# Altium project PCB_Project.PrjPcb (part 2 of 2)
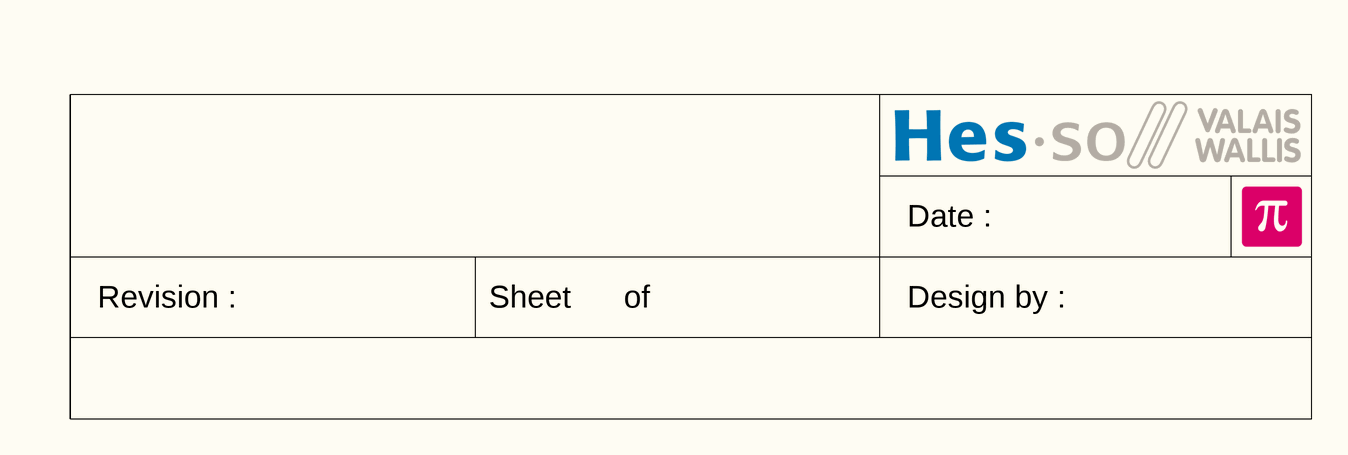
[diagram p12: UserInterface_0.SchDoc, right]

## Nets that join several sheets
+1.2V_CORE: FPGA_1 (31 pins), Supply_0 (R62.2)
+3V3_BACKPLANE: Connector_0 (6 pins), Supply_0 (6 pins)
+3V3_D: FPGA_0 (R26.2 R29.2 R57.2), FPGA_1 (97 pins), Ethernet_0 (13 pins), Connector_0 (12 pins), Supply_0 (J8.2), UserInterface_0 (7 pins)
+5V_MEZZA: Connector_0 (J2.a25 J11.a25), Supply_0 (J7.2)
GND_D: FPGA_0 (R27.1 R28.1 R56.1), FPGA_1 (113 pins), Ethernet_0 (29 pins), Connector_0 (58 pins), Supply_0 (13 pins), UserInterface_0 (14 pins)
NetC29_2: FPGA_0 (U2.B2), UserInterface_0 (C29.2 R49.1 S4.2)
NetC30_2: FPGA_0 (U2.B1), UserInterface_0 (C30.2 R50.1 S5.2)
NetC31_2: FPGA_0 (U2.G7), UserInterface_0 (C31.2 R51.1 S3.2)
NetC34_2: FPGA_0 (U2.J7), FPGA_1 (C34.2 R36.1 S2.2)
NetD2_1: FPGA_0 (U2.V2), Ethernet_0 (D2.1)
NetIC1_18: FPGA_0 (U2.M5), Ethernet_0 (IC1.18 R13.1)
NetIC1_19: FPGA_0 (U2.M4), Ethernet_0 (IC1.19)
NetIC1_20: FPGA_0 (U2.M6), Ethernet_0 (IC1.20)
NetIC1_21: FPGA_0 (U2.P4), Ethernet_0 (IC1.21)
NetIC1_22: FPGA_0 (U2.R4), Ethernet_0 (IC1.22)
NetIC1_23: FPGA_0 (U2.M8), Ethernet_0 (IC1.23)
NetIC1_27: FPGA_0 (U2.N7), Ethernet_0 (IC1.27)
NetIC1_28: FPGA_0 (U2.N6), Ethernet_0 (IC1.28)
NetIC1_29: FPGA_0 (U2.M7), Ethernet_0 (IC1.29)
NetIC1_32: FPGA_0 (U2.L6), Ethernet_0 (IC1.32)
NetIC1_33: FPGA_0 (U2.P6), Ethernet_0 (IC1.33)
NetIC1_34: FPGA_0 (U2.P5), Ethernet_0 (IC1.34)
NetIC1_35: FPGA_0 (U2.T4), Ethernet_0 (IC1.35)
NetIC1_36: FPGA_0 (U2.T3), Ethernet_0 (IC1.36)
NetIC1_38: FPGA_0 (U2.U4), Ethernet_0 (IC1.38)
NetIC1_39: FPGA_0 (U2.V3), Ethernet_0 (IC1.39)
NetIC1_40: FPGA_0 (U2.P3), Ethernet_0 (IC1.40)
NetIC1_41: FPGA_0 (U2.N4), Ethernet_0 (IC1.41)
NetJ1_a2: FPGA_0 (U2.AB11), Connector_0 (J1.a2 J10.a2), UserInterface_0 (JP1.2)
NetJ1_a3: FPGA_0 (U2.AA8), Connector_0 (J1.a3 J10.a3), UserInterface_0 (JP2.2)
NetJ1_a4: FPGA_0 (U2.AB8), Connector_0 (J1.a4 J10.a4), UserInterface_0 (JP3.2)
NetJ1_a5: FPGA_0 (U2.Y3), Connector_0 (J1.a5 J10.a5), UserInterface_0 (JP4.2)
NetJ1_a6: FPGA_0 (U2.AB3), Connector_0 (J1.a6 J10.a6)
NetJ1_a8: FPGA_0 (U2.AA10), Connector_0 (J1.a8 J10.a8)
NetJ1_a9: FPGA_0 (U2.AB10), Connector_0 (J1.a9 J10.a9)
NetJ1_a11: FPGA_0 (U2.AA12), Connector_0 (J1.a11 J10.a11)
NetJ1_a12: FPGA_0 (U2.AB12), Connector_0 (J1.a12 J10.a12)
NetJ1_b2: FPGA_0 (U2.AB16), Connector_0 (J1.b2 J10.b2)
NetJ1_b3: FPGA_0 (U2.Y13), Connector_0 (J1.b3 J10.b3)
NetJ1_b4: FPGA_0 (U2.W12), Connector_0 (J1.b4 J10.b4)
NetJ1_b5: FPGA_0 (U2.Y12), Connector_0 (J1.b5 J10.b5)
NetJ1_b6: FPGA_0 (U2.Y15), Connector_0 (J1.b6 J10.b6)
NetJ1_b8: FPGA_0 (U2.AA14), Connector_0 (J1.b8 J10.b8)
NetJ1_b9: FPGA_0 (U2.AB14), Connector_0 (J1.b9 J10.b9)
NetJ1_b11: FPGA_0 (U2.AA18), Connector_0 (J1.b11 J10.b11)
NetJ1_b12: FPGA_0 (U2.V15), Connector_0 (J1.b12 J10.b12)
NetJ1_b13: FPGA_0 (U2.AB18), Connector_0 (J1.b13 J10.b13)
NetJ1_b21: FPGA_0 (U2.F15), Connector_0 (J1.b21 J10.b21)
NetJ1_b22: FPGA_0 (U2.F14), Connector_0 (J1.b22 J10.b22)
NetJ1_b23: FPGA_0 (U2.A4), Connector_0 (J1.b23 J10.b23)
NetJ1_b25: FPGA_0 (U2.C5), Connector_0 (J1.b25 J10.b25)
NetJ2_a2: FPGA_0 (U2.A8), Connector_0 (J2.a2 J11.a2)
NetJ2_a3: FPGA_0 (U2.D9), Connector_0 (J2.a3 J11.a3)
NetJ2_a4: FPGA_0 (U2.C8), Connector_0 (J2.a4 J11.a4)
NetJ2_a6: FPGA_0 (U2.C9), Connector_0 (J2.a6 J11.a6)
NetJ2_a7: FPGA_0 (U2.D12), Connector_0 (J2.a7 J11.a7)
NetJ2_a8: FPGA_0 (U2.F13), Connector_0 (J2.a8 J11.a8)
NetJ2_a9: FPGA_0 (U2.A12), Connector_0 (J2.a9 J11.a9)
NetJ2_a10: FPGA_0 (U2.C13), Connector_0 (J2.a10 J11.a10)
NetJ2_a11: FPGA_0 (U2.A11), Connector_0 (J2.a11 J11.a11)
NetJ2_a13: FPGA_0 (U2.D11), Connector_0 (J2.a13 J11.a13)
NetJ2_a14: FPGA_0 (U2.C12), Connector_0 (J2.a14 J11.a14)
NetJ2_a16: FPGA_0 (U2.B12), Connector_0 (J2.a16 J11.a16)
NetJ2_a18: FPGA_0 (U2.A13), Connector_0 (J2.a18 J11.a18)
NetJ2_a19: FPGA_0 (U2.H13), Connector_0 (J2.a19 J11.a19)
NetJ2_a20: FPGA_0 (U2.H14), Connector_0 (J2.a20 J11.a20)
NetJ2_a21: FPGA_0 (U2.D14), Connector_0 (J2.a21 J11.a21)
NetJ2_a22: FPGA_0 (U2.G13), Connector_0 (J2.a22 J11.a22)
NetJ2_a23: FPGA_0 (U2.E14), Connector_0 (J2.a23 J11.a23)
NetJ2_a24: FPGA_0 (U2.C14), Connector_0 (J2.a24 J11.a24)
NetJ2_b2: FPGA_0 (U2.C10), Connector_0 (J2.b2 J11.b2)
NetJ2_b3: FPGA_0 (U2.B10), Connector_0 (J2.b3 J11.b3)
NetJ2_b4: FPGA_0 (U2.A10), Connector_0 (J2.b4 J11.b4)
NetJ2_b6: FPGA_0 (U2.C11), Connector_0 (J2.b6 J11.b6)
NetJ2_b7: FPGA_0 (U2.D8), Connector_0 (J2.b7 J11.b7)
NetJ2_b8: FPGA_0 (U2.D10), Connector_0 (J2.b8 J11.b8)
NetJ2_b9: FPGA_0 (U2.D13), Connector_0 (J2.b9 J11.b9)
NetJ2_b10: FPGA_0 (U2.D7), Connector_0 (J2.b10 J11.b10)
NetJ2_b11: FPGA_0 (U2.A9), Connector_0 (J2.b11 J11.b11)
NetJ2_b13: FPGA_0 (U2.E12), Connector_0 (J2.b13 J11.b13)
NetJ2_b16: FPGA_0 (U2.A7), Connector_0 (J2.b16 J11.b16)
NetJ2_b18: FPGA_0 (U2.B8), Connector_0 (J2.b18 J11.b18)
NetJ2_b19: FPGA_0 (U2.C6), Connector_0 (J2.b19 J11.b19)
NetJ2_b20: FPGA_0 (U2.B6), Connector_0 (J2.b20 J11.b20)
NetJ2_b21: FPGA_0 (U2.A5), Connector_0 (J2.b21 J11.b21)
NetJ2_b22: FPGA_0 (U2.D6), Connector_0 (J2.b22 J11.b22)
NetJ2_b23: FPGA_0 (U2.A6), Connector_0 (J2.b23 J11.b23)
NetJ2_b24: FPGA_0 (U2.C7), Connector_0 (J2.b24 J11.b24)
NetJ3_3: FPGA_1 (U2.C18), Connector_0 (J3.3 R4.1)
NetJ3_5: FPGA_1 (U2.G15), Connector_0 (J3.5 R3.1)
NetJ3_7: FPGA_1 (U2.A19), Connector_0 (J3.7 R2.1)
NetJ3_9: FPGA_1 (U2.E18), Connector_0 (J3.9 R1.1)
NetJ4_A2: FPGA_0 (U2.C19), Connector_0 (J4.A2)
NetJ4_A3: FPGA_0 (U2.B20), Connector_0 (J4.A3)
NetJ4_A5: FPGA_0 (U2.G16), Connector_0 (J4.A5)
NetJ4_A6: FPGA_0 (U2.G17), Connector_0 (J4.A6)
NetJ4_A8: FPGA_0 (U2.F16), Connector_0 (J4.A8)
NetJ4_A9: FPGA_0 (U2.F17), Connector_0 (J4.A9)
NetJ4_A11: FPGA_0 (U2.B21), Connector_0 (J4.A11)
NetJ4_A12: FPGA_0 (U2.B22), Connector_0 (J4.A12)
NetJ4_A14: FPGA_0 (U2.H19), Connector_0 (J4.A14)
NetJ4_A15: FPGA_0 (U2.H18), Connector_0 (J4.A15)
NetJ4_A16: FPGA_0 (U2.E20), Connector_0 (J4.A16)
NetJ4_A17: FPGA_0 (U2.E22), Connector_0 (J4.A17)
NetJ4_A19: FPGA_0 (U2.J17), Connector_0 (J4.A19)
NetJ4_A20: FPGA_0 (U2.K17), Connector_0 (J4.A20)
NetJ4_A21: FPGA_0 (U2.F21), Connector_0 (J4.A21)
NetJ4_A22: FPGA_0 (U2.F22), Connector_0 (J4.A22)
NetJ4_A24: FPGA_0 (U2.H20), Connector_0 (J4.A24)
NetJ4_A25: FPGA_0 (U2.J19), Connector_0 (J4.A25)
NetJ4_A26: FPGA_0 (U2.G20), Connector_0 (J4.A26)
NetJ4_A27: FPGA_0 (U2.G22), Connector_0 (J4.A27)
NetJ4_A29: FPGA_0 (U2.M19), Connector_0 (J4.A29)
NetJ4_B2: FPGA_0 (U2.A20), Connector_0 (J4.B2)
NetJ4_B3: FPGA_0 (U2.A21), Connector_0 (J4.B3)
NetJ4_B5: FPGA_0 (U2.K16), Connector_0 (J4.B5)
NetJ4_B6: FPGA_0 (U2.J16), Connector_0 (J4.B6)
NetJ4_B8: FPGA_0 (U2.H16), Connector_0 (J4.B8)
NetJ4_B9: FPGA_0 (U2.H17), Connector_0 (J4.B9)
NetJ4_B11: FPGA_0 (U2.D19), Connector_0 (J4.B11)
NetJ4_B12: FPGA_0 (U2.D20), Connector_0 (J4.B12)
NetJ4_B14: FPGA_0 (U2.K20), Connector_0 (J4.B14)
NetJ4_B15: FPGA_0 (U2.K19), Connector_0 (J4.B15)
NetJ4_B16: FPGA_0 (U2.H21), Connector_0 (J4.B16)
NetJ4_B17: FPGA_0 (U2.H22), Connector_0 (J4.B17)
NetJ4_B19: FPGA_0 (U2.M20), Connector_0 (J4.B19)
NetJ4_B20: FPGA_0 (U2.L19), Connector_0 (J4.B20)
NetJ4_B21: FPGA_0 (U2.J20), Connector_0 (J4.B21)
NetJ4_B22: FPGA_0 (U2.J22), Connector_0 (J4.B22)
NetJ4_B24: FPGA_0 (U2.K21), Connector_0 (J4.B24)
NetJ4_B25: FPGA_0 (U2.K22), Connector_0 (J4.B25)
NetJ4_B26: FPGA_0 (U2.L20), Connector_0 (J4.B26)
NetJ4_B27: FPGA_0 (U2.L22), Connector_0 (J4.B27)
NetJ4_B29: FPGA_0 (U2.N19), Connector_0 (J4.B29 R8.1)
NetJ4_C2: FPGA_0 (U2.F18), Connector_0 (J4.C2)
NetJ4_C3: FPGA_0 (U2.F19), Connector_0 (J4.C3)
NetJ4_C5: FPGA_0 (U2.D21), Connector_0 (J4.C5)
NetJ4_C6: FPGA_0 (U2.D22), Connector_0 (J4.C6)
NetJ4_C8: FPGA_0 (U2.C20), Connector_0 (J4.C8)
NetJ4_C9: FPGA_0 (U2.C22), Connector_0 (J4.C9)
NetJ4_C11: FPGA_0 (U2.G19), Connector_0 (J4.C11)
NetJ4_C12: FPGA_0 (U2.F20), Connector_0 (J4.C12)
NetJ4_C14: FPGA_0 (U2.M21), Connector_0 (J4.C14)
NetJ4_C15: FPGA_0 (U2.M22), Connector_0 (J4.C15)
NetJ4_C16: FPGA_0 (U2.N20), Connector_0 (J4.C16)
NetJ4_C17: FPGA_0 (U2.P22), Connector_0 (J4.C17)
NetJ4_C19: FPGA_0 (U2.R20), Connector_0 (J4.C19)
NetJ4_C20: FPGA_0 (U2.R22), Connector_0 (J4.C20)
NetJ4_C21: FPGA_0 (U2.T21), Connector_0 (J4.C21)
NetJ4_C22: FPGA_0 (U2.T22), Connector_0 (J4.C22)
NetJ4_C24: FPGA_0 (U2.U20), Connector_0 (J4.C24)
NetJ4_C25: FPGA_0 (U2.U22), Connector_0 (J4.C25)
NetJ4_C26: FPGA_0 (U2.V21), Connector_0 (J4.C26)
NetJ4_C27: FPGA_0 (U2.V22), Connector_0 (J4.C27)
NetJ4_C29: FPGA_0 (U2.M16), Connector_0 (J4.C29 R9.1)
NetLD4_2: FPGA_0 (U2.K2), UserInterface_0 (LD4.2)
NetLD4_4: FPGA_0 (U2.L3), UserInterface_0 (LD4.4)
NetLD4_6: FPGA_0 (U2.M2), UserInterface_0 (LD4.6)
NetLD4_8: FPGA_0 (U2.N3), UserInterface_0 (LD4.8)
NetLD5_2: FPGA_0 (U2.P1), UserInterface_0 (LD5.2)
NetLD5_4: FPGA_0 (U2.R1), UserInterface_0 (LD5.4)
NetLD5_6: FPGA_0 (U2.T1), UserInterface_0 (LD5.6)
NetLD5_8: FPGA_0 (U2.U1), UserInterface_0 (LD5.8)
NetR31_1: FPGA_0 (U2.T5), FPGA_1 (R31.1 U3.1)
NetR33_1: FPGA_0 (U2.Y21), FPGA_1 (R33.1 R38.2 U3.6)
NetR41_1: FPGA_0 (U2.N1), UserInterface_0 (R41.1)
NetR42_1: FPGA_0 (U2.U3), UserInterface_0 (R42.1)
NetR43_1: FPGA_0 (U2.M1), UserInterface_0 (R43.1)
NetR44_1: FPGA_0 (U2.T2), UserInterface_0 (R44.1)
NetR45_1: FPGA_0 (U2.L1), UserInterface_0 (R45.1)
NetR46_1: FPGA_0 (U2.R3), UserInterface_0 (R46.1)
NetR47_1: FPGA_0 (U2.K1), UserInterface_0 (R47.1)
NetR48_1: FPGA_0 (U2.P2), UserInterface_0 (R48.1)
NetS6_2: FPGA_0 (U2.B3), UserInterface_0 (S6.2)
NetS6_4: FPGA_0 (U2.A2), UserInterface_0 (S6.4)
NetS6_6: FPGA_0 (U2.E6), UserInterface_0 (S6.6)
NetS6_8: FPGA_0 (U2.E5), UserInterface_0 (S6.8)
NetU1_2: FPGA_0 (U2.Y1), Connector_0 (U1.2)
NetU1_8: FPGA_0 (U2.W1), Connector_0 (U1.8)
NetU1_30: FPGA_0 (U2.Y2), Connector_0 (U1.30)
NetU1_32: FPGA_0 (U2.W3), Connector_0 (U1.32)
NetU2_AA20: FPGA_0 (U2.AA20), FPGA_1 (U3.2)
NetU2_AB20: FPGA_0 (U2.AB20), FPGA_1 (U3.5)
NetU2_J3: FPGA_0 (U2.J3), FPGA_1 (X2.3)